# Altium schematic sheet WP_STM32.SchDoc
size 420 x 297 mm; SheetNumber: 1; SheetTotal: 1; SPICEModelCacheUDGBDIBM: <root> / <DocumentId>UDGBDIBM</DocumentId> / <CacheFrame Number="0"> / <Model Name="led2" Kind="MDL"> / <Text>*Typ RED,GREEN,YELLOW,AMBER GaAs LED: Vf=2.1V Vr=4V If=40mA trr=3uS / *LED Pinout: 1=A, 2=K / .MODEL LED2 D (IS=93.1P RS=42M N=4.61 BV=4 IBV=10U / + CJO=2.97P VJ=.75 M=.333 TT=4.32U)</Text> / </Model> / </CacheFrame> / </root>
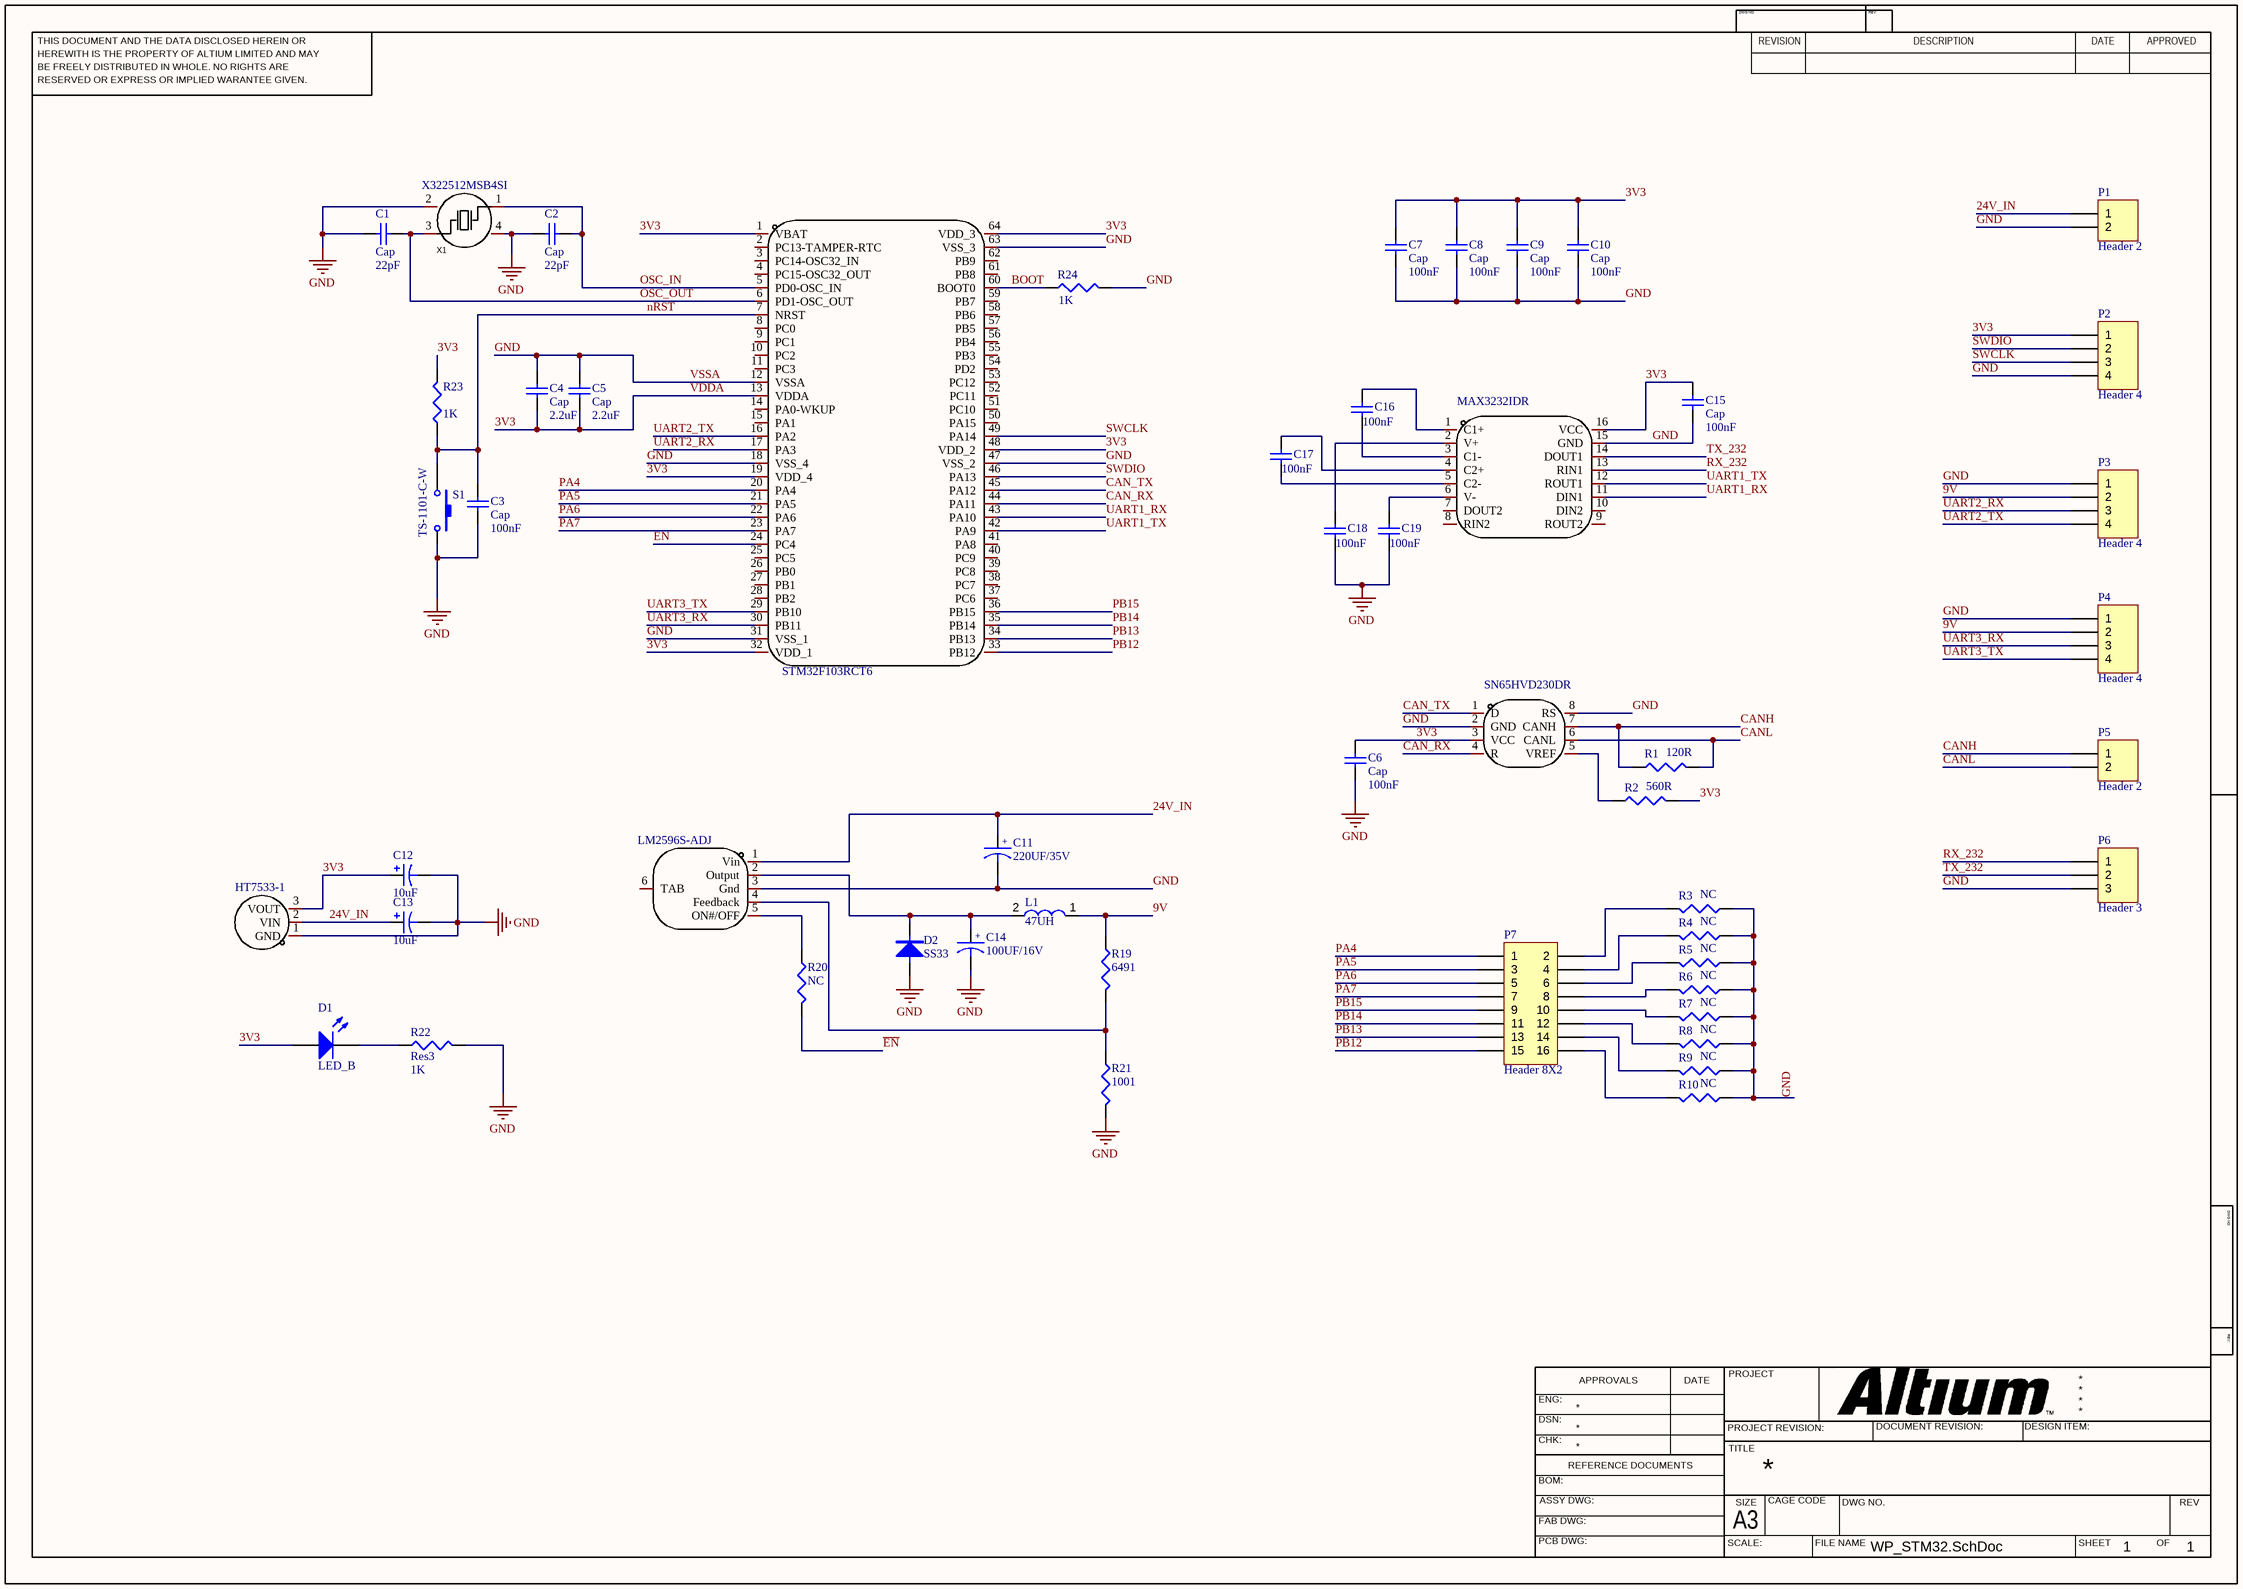
[diagram p0: WP_STM32.SchDoc]

## Parts
C1  Cap  value 22pF  [0603C]
C2  Cap  value 22pF  [0603C]
C3  Cap  value 100nF  [0603C]
C4  Cap  value 2.2uF  [0603C]
C5  Cap  value 2.2uF  [0603C]
C6  Cap  value 100nF  [0603C]
C7  Cap  value 100nF  [0603C]
C8  Cap  value 100nF  [0603C]
C9  Cap  value 100nF  [0603C]
C10  Cap  value 100nF  [0603C]
C11  220UF/35V  [CAP-TH_BD8.0-P3.50-D0.6-FD]
C12  value 10uF  [LC-CASE-A_3216]  (hidden comment: Cap Pol3)
C13  value 10uF  [LC-CASE-A_3216]  (hidden comment: Cap Pol3)
C14  100UF/16V  [CAP-TH_BD5.0-P2.00-D0.5-FD-1]
C15  Cap  value 100nF  [0603C]
C16  value 100nF  [0603C]  (hidden comment: Cap)
C17  value 100nF  [0603C]  (hidden comment: Cap)
C18  value 100nF  [0603C]  (hidden comment: Cap)
C19  value 100nF  [0603C]  (hidden comment: Cap)
D1  LED_B  [0603D]
D2  SS33  [LC-SMA(DO-214AC)]
L1  47UH  [IND-SMD_L10.8-W10.0_SLO1040H]
P1  Header 2  [KF350-2P]
P2  Header 4  [MX 1.25-LI-4P]
P3  Header 4  [MX 1.25-LI-4P]
P4  Header 4  [MX 1.25-LI-4P]
P5  Header 2  [MX 1.25-LI-2P]
P6  Header 3  [MX 1.25-LI-3P]
P7  Header 8X2  [HDR2X8]
R1  value 120R  [0603R]  (hidden comment: Res3)
R2  value 560R  [0603R]  (hidden comment: Res3)
R3  value NC  [0603R]  (hidden comment: Res3)
R4  value NC  [0603R]  (hidden comment: Res3)
R5  value NC  [0603R]  (hidden comment: Res3)
R6  value NC  [0603R]  (hidden comment: Res3)
R7  value NC  [0603R]  (hidden comment: Res3)
R8  value NC  [0603R]  (hidden comment: Res3)
R9  value NC  [0603R]  (hidden comment: Res3)
R10  value NC  [0603R]  (hidden comment: Res3)
R19  value 6491  [0603R]  (hidden comment: Res3)
R20  value NC  [0603R]  (hidden comment: Res3)
R21  value 1001  [0603R]  (hidden comment: Res3)
R22  Res3  value 1K  [0603R]
R23  value 1K  [0603R]  (hidden comment: Res3)
R24  value 1K  [0603R]  (hidden comment: Res3)
S1  TS-1101-C-W  [SW-SMD_L3.9-W3.0-P4.45]
U1  STM32F103RCT6  [LQFP-64_L10.0-W10.0-P0.50-LS12.0-BL]
U2  SN65HVD230DR  [SOP8]
U3  LM2596S-ADJ  [TO-263-5_L10.2-W8.9-P1.70-BR]
U4  HT7533-1  [SOT89]
U5  MAX3232IDR  [SOP16]
X1  X322512MSB4SI  [OSC-SMD_4P-L3.2-W2.5-BL]

## Nets
GND: C1.1 C2.1 C3.2 C4.2 C5.2 C6.1 C7.1 C8.1 C9.1 C10.1 C11.2 C12.2 C13.2 C14.2 C15.2 C18.2 C19.2 D2.1(A) P1.2 P2.4 P3.1 P4.1 P6.3 R3.1 R4.1 R5.1 R6.1 R7.1 R8.1 R9.1 R10.1 R21.2 R22.2 R24.2 S1.2 U1.12(VSSA) U1.18(VSS_4) U1.31(VSS_1) U1.47(VSS_2) U1.63(VSS_3) U2.2(GND) U2.8(RS) U3.3(Gnd) U4.1(GND) U5.15(GND) X1.2(GND) X1.4(GND)  [also labelled VSSA]
3V3: C4.1 C5.1 C6.2 C7.2 C8.2 C9.2 C10.2 C12.1 C15.1 D1.1(A) P2.1 R2.2 R23.2 U1.1(VBAT) U1.13(VDDA) U1.19(VDD_4) U1.32(VDD_1) U1.48(VDD_2) U1.64(VDD_3) U2.3(VCC) U4.3(VOUT) U5.16(VCC)  [also labelled VDDA]
9V: L1.1 P3.2 P4.2 R19.1
24V_IN: C11.1 C13.1 P1.1 U3.1(Vin) U4.2(VIN)
~{EN}: R20.2 U1.24(PC4)
BOOT: R24.1 U1.60(BOOT0)
CAN_RX: U1.44(PA11) U2.4(R)
CAN_TX: U1.45(PA12) U2.1(D)
CANH: P5.1 R1.1 U2.7(CANH)
CANL: P5.2 R1.2 U2.6(CANL)
nRST: C3.1 R23.1 S1.1 U1.7(NRST)
OSC_IN: C2.2 U1.5(PD0-OSC_IN) X1.1(OSC1)
OSC_OUT: C1.2 U1.6(PD1-OSC_OUT) X1.3(OSC2)
PA4: P7.1 U1.20(PA4)
PA5: P7.3 U1.21(PA5)
PA6: P7.5 U1.22(PA6)
PA7: P7.7 U1.23(PA7)
PB12: P7.15 U1.33(PB12)
PB13: P7.13 U1.34(PB13)
PB14: P7.11 U1.35(PB14)
PB15: P7.9 U1.36(PB15)
RX_232: P6.1 U5.13(RIN1)
SWCLK: P2.3 U1.49(PA14)
SWDIO: P2.2 U1.46(PA13)
TX_232: P6.2 U5.14(DOUT1)
UART1_RX: U1.43(PA10) U5.11(DIN1)
UART1_TX: U1.42(PA9) U5.12(ROUT1)
UART2_RX: P3.3 U1.17(PA3)
UART2_TX: P3.4 U1.16(PA2)
UART3_RX: P4.3 U1.30(PB11)
UART3_TX: P4.4 U1.29(PB10)
NetC14_1: C14.1 D2.2(K) L1.2 U3.2(Output)
NetC16_1: C16.1 U5.1(C1+)
NetC16_2: C16.2 U5.3(C1-)
NetC17_1: C17.1 U5.4(C2+)
NetC17_2: C17.2 U5.5(C2-)
NetC18_1: C18.1 U5.2(V+)
NetC19_1: C19.1 U5.6(V-)
NetD1_2: D1.2(K) R22.1
NetP7_2: P7.2 R3.2
NetP7_4: P7.4 R4.2
NetP7_6: P7.6 R5.2
NetP7_8: P7.8 R6.2
NetP7_10: P7.10 R7.2
NetP7_12: P7.12 R8.2
NetP7_14: P7.14 R9.2
NetP7_16: P7.16 R10.2
NetR2_1: R2.1 U2.5(VREF)
NetR19_2: R19.2 R21.1 U3.4(Feedback)
NetR20_1: R20.1 U3.5(ON#/OFF)

Not connected (* = marked no-connect by the designer): U1 2(PC13-TAMPER-RTC) 3(PC14-OSC32_IN) 4(PC15-OSC32_OUT) 8(PC0) 9(PC1) 10(PC2) 11(PC3) 14(PA0-WKUP) 15(PA1) 25(PC5) 26(PB0) 27(PB1) 28(PB2) 37(PC6) 38(PC7) 39(PC8) 40(PC9) 41(PA8) 50(PA15) 51(PC10) 52(PC11) 53(PC12) 54(PD2) 55(PB3) 56(PB4) 57(PB5) 58(PB6) 59(PB7) 61(PB8) 62(PB9); U3 6(TAB); U5 7(DOUT2) 8(RIN2) 9(ROUT2) 10(DIN2)

## Notes on the sheet
- THIS DOCUMENT AND THE DATA DISCLOSED HEREIN OR
- HEREWITH IS THE PROPERTY OF ALTIUM LIMITED AND MAY
- DWG NO:
- REVISION
- REV:
- DESCRIPTION
- DATE
- APPROVED
- BE FREELY DISTRIBUTED IN WHOLE. NO RIGHTS ARE
- RESERVED OR EXPRESS OR IMPLIED WARANTEE GIVEN.
- ENG:
- APPROVALS
- PROJECT
- DSN:
- CHK:
- REFERENCE DOCUMENTS
- PROJECT REVISION:
- TITLE
- DOCUMENT REVISION:
- DESIGN ITEM:
- BOM:
- FAB DWG:
- PCB DWG:
- ASSY DWG:
- SCALE:
- A3
- SIZE
- CAGE CODE
- FILE NAME
- DWG NO.
- SHEET
- OF
- REV
- (in symbol C+) +

## Library data of the parts
C1-C10 C15-C19 = Cap: Capacitor; Published: 8-Jun-2000; LatestRevisionDate: 17-Jul-2002; LatestRevisionNote: Re-released for DXP Platform.; PackageReference: RAD-0.3; Publisher: Altium Limited; PackageDescription: Radial Cap, Thru-Hole; 2 Leads; 0.3 in Pin Spacing
C11 C14 = C+
C12 C13 = Cap Pol3: Polarized Capacitor (Surface Mount); Published: 8-Jun-2000; LatestRevisionDate: 29-May-2009; LatestRevisionNote: IPC-7351 Footprint Added.; PackageReference: C0805; Publisher: Altium Limited; PackageDescription: Chip Capacitor
D1 = LED2: Typical RED, GREEN, YELLOW, AMBER GaAs LED; Published: 8-Jun-2000; LatestRevisionDate: 17-Jul-2002; LatestRevisionNote: Re-released for DXP Platform.; PackageVersion: Feb-2002; PackageReference: 3.2X1.6X1.1; Publisher: Altium Limited; PackageDescription: SM LED; 2 Flat Leads
D2 = D
L1 = L
P1 P5 = Header 2: Header, 2-Pin; LatestRevisionDate: 17-Jul-2002; LatestRevisionNote: Re-released for DXP Platform.; Publisher: Altium Limited
P2-P4 = Header 4: Header, 4-Pin; LatestRevisionDate: 17-Jul-2002; LatestRevisionNote: Re-released for DXP Platform.; Publisher: Altium Limited
P6 = Header 3: Header, 3-Pin; LatestRevisionDate: 17-Jul-2002; LatestRevisionNote: Re-released for DXP Platform.; Publisher: Altium Limited
P7 = Header 8X2: Header, 8-Pin, Dual row; LatestRevisionDate: 17-Jul-2002; LatestRevisionNote: Re-released for DXP Platform.; Publisher: Altium Limited
R1-R10 R19-R24 = Res3: Resistor; Published: 8-Jun-2000; LatestRevisionDate: 29-May-2009; LatestRevisionNote: IPC-7351 Footprint Added.; PackageReference: J1-0603; Publisher: Altium Limited; PackageDescription: Chip Resistor
S1 = SW-PB: Switch; Published: 24-Mar-1999; LatestRevisionDate: 17-Jul-2002; LatestRevisionNote: Re-released for DXP Platform.; PackageReference: SPST-2; Publisher: Altium Limited; PackageDescription: Switch; 2 Leads
U1 = STM32F103RCT6: Manufacturer: ST(意法半导体); Add into BOM: yes; CPU Core: CM3; Program Storage Size: 256KB; RAM Size: 48KB; GPIO Ports Number: 51; Operating Voltage Range: 2V~3.6V; CPU Maximum Speed: 72MHz; Program Memory Type: FLASH; ADC (Bit): 12bit; Universal Serial Bus: 有; Peripheral/Function: DMA；片载温度传感器；PWM; Symbol: STM32F103RCT6; Device: STM32F103RCT6; LCSC Part Name: STM32F103RCT6; Supplier Part: C8323; Manufacturer Part: STM32F103RCT6; Supplier Footprint: LQFP-64(10x10); JLCPCB Part Class: Extended Part; Datasheet: https://atta.szlcsc.com/upload/public/pdf/source/20180207/C88442_15179953708671359491.pdf; Supplier: LCSC; Convert to PCB: yes; Operating Temperature Range: -40℃~+85℃; DAC (Bit): 12bit; PWM (Bit): -; Internal Comparator: -; communication protocol: -; Watchdog: 有; Real-Time Clock: -; Infrared Data Association: 有; Low-Voltage Detect: 有; CCP Capture/Compare: -; Secure Digital Input and Output: -; Direct Memory Access: 有; Internal Oscillator: 有
U2 = SN65HVD230DR: Manufacturer: TI(德州仪器); Add into BOM: yes; Data Rate: 1Mbps; Supply Voltage: 3V~3.6V; Name: SN65HVD230DR; Symbol: SN65HVD230DR; Device: SN65HVD230DR; LCSC Part Name: 1Mbps 3V~3.6V; Supplier Part: C12084; Manufacturer Part: SN65HVD230DR; Supplier Footprint: SOIC-8; JLCPCB Part Class: Basic Part; Datasheet: https://atta.szlcsc.com/upload/public/pdf/source/20140508/1457707055452.pdf; Supplier: LCSC; Convert to PCB: yes; Type: 收发器
U3 = LM2596S-ADJ_C347423: Manufacturer: UMW(友台半导体); Add into BOM: yes; Function: 降压型; Output Type: 可调; Input Voltage: 40V; Output Voltage: 1.2V~37V; Output Current (Max): 3A; Switching Frequency: 150kHz; Synchronous Rectification: 否; Number of Outputs: 1; Topology: 降压式; Switch tube (built-in/external): 内置; Symbol: LM2596S-ADJ; Device: LM2596S-ADJ_C347423; LCSC Part Name: LM2596S-ADJ; Supplier Part: C347423; Manufacturer Part: LM2596S-ADJ; Supplier Footprint: TO-263-5; JLCPCB Part Class: Extended Part; Datasheet: https://atta.szlcsc.com/upload/public/pdf/source/20230506/0930E65C3A8B7B120C8A4D8E5A8AC327.pdf; Supplier: LCSC; Convert to PCB: yes; Operating Temperature: -40℃~+125℃@(TA)
U4 = HT7533-1_C347186: Manufacturer: UMW(友台半导体); Add into BOM: yes; Output Type: 固定; Maximum Input Voltage: 30V; Output Voltage: 3.3V; MAX Output Current: 100mA; Dropout Voltage: 100mV@(1mA); standby current: 3uA; Output Polarity: 正极; Number of Outputs: 1; Symbol: HT7533-1_C347186; Device: HT7533-1_C347186; LCSC Part Name: 输入30V 输出3.3V 100mA; Supplier Part: C347186; Manufacturer Part: HT7533-1; Supplier Footprint: SOT-89; JLCPCB Part Class: Extended Part; Datasheet: https://atta.szlcsc.com/upload/public/pdf/source/20231109/E587E38465720CDF1B9E4B203F8DC229.pdf; Supplier: LCSC; Convert to PCB: yes; Power Supply Rejection Ratio (PSRR): -; Operating Temperature: -25℃~+70℃
U5 = MAX3232IDR: Manufacturer: TI(德州仪器); Add into BOM: yes; Types: 收发器; Driver/receiver: 2/2; Data Rate: 250Kbps; Supply Voltage: 3V~5.5V; Symbol: MAX3232IDR; Device: MAX3232IDR; LCSC Part Name: 具有±15kV ESD 保护功能的MAX3232 3V至5.5V多通道RS-232线路驱动器和接收器; Supplier Part: C18261; Manufacturer Part: MAX3232IDR; Supplier Footprint: SOIC-16; JLCPCB Part Class: Extended Part; Datasheet: https://www.ti.com/cn/lit/gpn/max3232; Supplier: LCSC; Convert to PCB: yes; Operating Temperature: -40℃~+85℃
X1 = X322512MSB4SI: Manufacturer: YXC(扬兴晶振); Add into BOM: yes; Crystal Type: 贴片晶振; Value: 12MHz; Normal temperature Frequency Tolerance: ±10ppm; External load capacitor: 20pF; Frequency Stability(Full temperature range): ±30ppm; Symbol: X322512MSB4SI; Device: X322512MSB4SI; LCSC Part Name: 12MHz ±10ppm 20pF; Supplier Part: C9002; Manufacturer Part: X322512MSB4SI; Supplier Footprint: SMD3225-4P; JLCPCB Part Class: Basic Part; Datasheet: https://atta.szlcsc.com/upload/public/pdf/source/20210329/C112971_1F611BDC486E193C1706F6D8EB5AA189.pdf; Supplier: LCSC; Convert to PCB: yes; Operating Temperature: -40℃~+85℃